# Altium schematic sheet BrushlessDrive.SchDoc: Drive global
size Letter; Organization: Robocup Ulaval; DocumentNumber: 1; Revision: 1.0; SheetNumber: 1; SheetTotal: 2; Conceptor: Philippe T. Simon B. Léonard G. Alexia B-L.; Version: Gamma 1.0
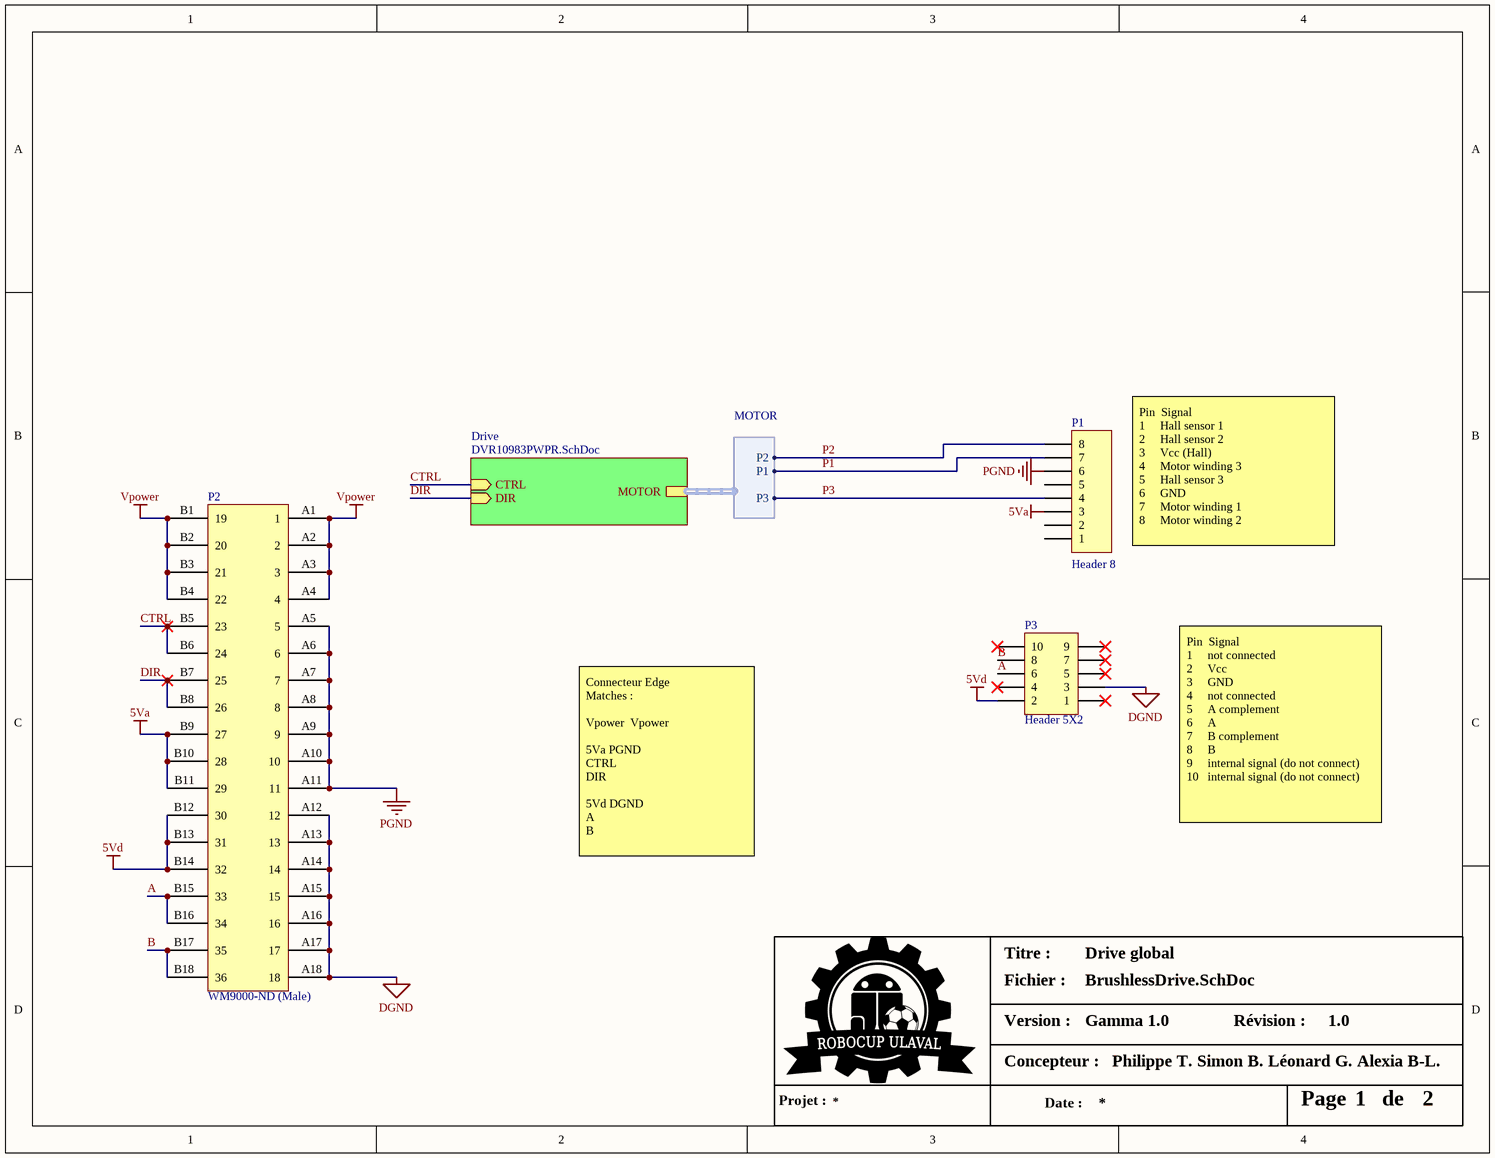
[diagram p0: BrushlessDrive.SchDoc]

## Parts
P1  Header 8  [HallSensor Connector]
P2  WM9000-ND (Male)  [Edge connector 36Pos]
P3  Header 5X2  [Encoder Connector]

## Sub-sheets
Drive = DVR10983PWPR.SchDoc: MOTOR (harness MOTOR), CTRL (in), DIR (in)

## Harnesses
MOTOR: P1, P2, P3

## Nets
5Va: P1.3 P2.B9(27) P2.B10(28) P2.B11(29)
5Vd: P2.B12(30) P2.B13(31) P2.B14(32) P3.2
DGND: P2.A12(12) P2.A13(13) P2.A14(14) P2.A15(15) P2.A16(16) P2.A17(17) P2.A18(18) P3.3
PGND: P1.6 P2.A5(5) P2.A6(6) P2.A7(7) P2.A8(8) P2.A9(9) P2.A10(10) P2.A11(11)
Vpower: P2.A1(1) P2.A2(2) P2.A3(3) P2.A4(4) P2.B1(19) P2.B2(20) P2.B3(21) P2.B4(22)
A: P2.B15(33) P2.B16(34) P3.6
B: P2.B17(35) P2.B18(36) P3.8
CTRL: P2.B5(23) P2.B6(24) ; sheet Drive/CTRL
DIR: P2.B7(25) P2.B8(26) ; sheet Drive/DIR
P1: P1.7 ; sheet Drive/MOTOR.P1
P2: P1.8 ; sheet Drive/MOTOR.P2
P3: P1.4 ; sheet Drive/MOTOR.P3

Not connected (* = marked no-connect by the designer): P1 1 2 5; P3 1* 4* 5* 7* 9* 10*

## Notes on the sheet
- Pin  Signal
  1     Hall sensor 1
  2     Hall sensor 2
  3     Vcc (Hall)
  4     Motor winding 3
  5     Hall sensor 3
  6     GND
  7     Motor winding 1
  8     Motor winding 2
- Pin  Signal
  1     not connected
  2     Vcc
  3     GND
  4     not connected
  5     A complement
  6     A
  7     B complement
  8     B
  9     internal signal (do not connect)
  10   internal signal (do not connect)
- Connecteur Edge
  Matches :
  Vpower 	Vpower
  5Va	PGND
  CTRL
  DIR
  5Vd	DGND
  A
  B
- Titre :
- Version :
- Fichier :
- Révision :
- Projet :
- Concepteur :
- Date :
- Page
- de

## Library data of the parts
P1 = Header 8: Header, 8-Pin; LatestRevisionDate: 17-Jul-2002; LatestRevisionNote: Re-released for DXP Platform.; Publisher: Altium Limited
P3 = Header 5X2: Header, 5-Pin, Dual row; LatestRevisionDate: 17-Jul-2002; LatestRevisionNote: Re-released for DXP Platform.; Publisher: Altium Limited